# Altium schematic sheet HD1772.SchDoc: ARM2 to ARM3 Adapter
size A3; DocumentNumber: 1; SheetNumber: 1; SheetTotal: 1
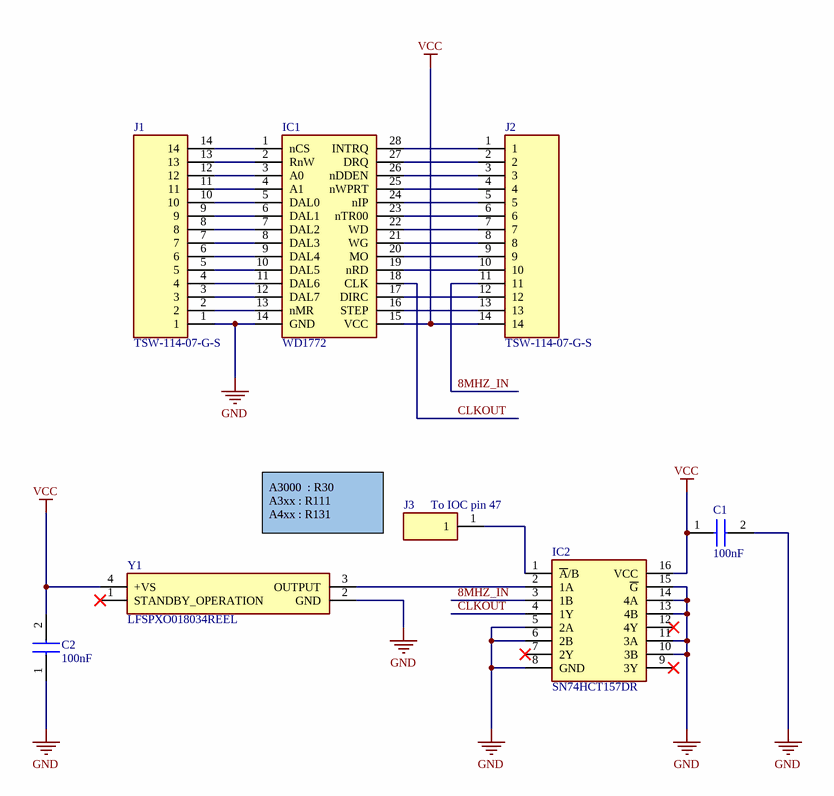
[diagram p0: HD1772.SchDoc]

## Parts
C1  100nF  [CAPC2012X145N]
C2  100nF  [CAPC2012X145N]
IC1  WD1772  [DIP1556W56P254L3740H635Q28N]
IC2  SN74HCT157DR  [SOIC127P600X175-16N]
J1  TSW-114-07-G-S  [TSW-114-XX-YY-S]
J2  TSW-114-07-G-S  [TSW-114-XX-YY-S]
J3  To IOC pin 47  [TSW-101-XX-YY-S]
Y1  LFSPXO018034REEL  [LFSPXO018034REEL]

## Nets
GND: C1.2 C2.1 IC1.14(GND) IC2.5(2A) IC2.6(2B) IC2.8(GND) IC2.10(3B) IC2.11(3A) IC2.13(4B) IC2.14(4A) IC2.15(~{G}) J1.1 Y1.2(GND)
VCC: C1.1 C2.2 IC1.15(VCC) IC2.16(VCC) J2.14 Y1.4(+VS)
8MHZ_IN: IC2.3(1B) J2.11
CLKOUT: IC1.18(CLK) IC2.4(1Y)
NetIC1_1: IC1.1(nCS) J1.14
NetIC1_2: IC1.2(RnW) J1.13
NetIC1_3: IC1.3(A0) J1.12
NetIC1_4: IC1.4(A1) J1.11
NetIC1_5: IC1.5(DAL0) J1.10
NetIC1_6: IC1.6(DAL1) J1.9
NetIC1_7: IC1.7(DAL2) J1.8
NetIC1_8: IC1.8(DAL3) J1.7
NetIC1_9: IC1.9(DAL4) J1.6
NetIC1_10: IC1.10(DAL5) J1.5
NetIC1_11: IC1.11(DAL6) J1.4
NetIC1_12: IC1.12(DAL7) J1.3
NetIC1_13: IC1.13(nMR) J1.2
NetIC1_16: IC1.16(STEP) J2.13
NetIC1_17: IC1.17(DIRC) J2.12
NetIC1_19: IC1.19(nRD) J2.10
NetIC1_20: IC1.20(MO) J2.9
NetIC1_21: IC1.21(WG) J2.8
NetIC1_22: IC1.22(WD) J2.7
NetIC1_23: IC1.23(nTR00) J2.6
NetIC1_24: IC1.24(nIP) J2.5
NetIC1_25: IC1.25(nWPRT) J2.4
NetIC1_26: IC1.26(nDDEN) J2.3
NetIC1_27: IC1.27(DRQ) J2.2
NetIC1_28: IC1.28(INTRQ) J2.1
NetIC2_1: IC2.1(~{A}/B) J3.1
NetIC2_2: IC2.2(1A) Y1.3(OUTPUT)

Not connected (* = marked no-connect by the designer): IC2 7(2Y)* 9(3Y)* 12(4Y)*; Y1 1(STANDBY_OPERATION)*

## Notes on the sheet
- A3000  : R30
  A3xx : R111
  A4xx : R131
- SIZE
- CODION LTD
- DIMENSIONS
- TITLE
- VARIANT
- REVISION
- DATE
- A3
- SHEET
- OF
- FILE
- DRAWN BY

## Library data of the parts
C1 C2 = C2012X7R1H104K125AM: Capacitor; Manufacturer_Name: TDK; Datasheet Link: https://product.tdk.com/info/en/catalog/datasheets/mlcc_commercial_midvoltage_en.pdf; Height: 1.45mm; Manufacturer_Part_Number: C2012X7R1H104K125AM; Mouser Part Number: 810-C2012X7R1H104KT5; Mouser Price/Stock: https://www.mouser.com/Search/Refine.aspx?Keyword=810-C2012X7R1H104KT5; Arrow Part Number: C2012X7R1H104K125AM; Arrow Price/Stock: https://www.arrow.com/en/products/c2012x7r1h104k125am/tdk
IC1 = WD1772: Integrated Circuit; Height: 6.35mm; Manufacturer_Part_Number: WD1772
IC2 = SN74HCT157DR: Integrated Circuit; Manufacturer_Name: Texas Instruments; Datasheet Link: http://www.ti.com/lit/ds/symlink/sn74hct157.pdf; Height: 1.75mm; Manufacturer_Part_Number: SN74HCT157DR; Mouser Part Number: 595-SN74HCT157DR; Mouser Price/Stock: https://www.mouser.co.uk/ProductDetail/Texas-Instruments/SN74HCT157DR?qs=SL3LIuy2dWwDjupbumH9IA%3D%3D; Arrow Part Number: SN74HCT157DR; Arrow Price/Stock: https://www.arrow.com/en/products/sn74hct157dr/texas-instruments
J1 J2 = TSW-114-07-G-S: Connector; Manufacturer_Name: SAMTEC; Datasheet Link: http://suddendocs.samtec.com/prints/tsw-xxx-xx-xxx-x-xx-xxx-mkt.pdf; Manufacturer_Part_Number: TSW-114-07-G-S; Mouser Part Number: 200-TSW11407GS; Mouser Price/Stock: https://www.mouser.co.uk/ProductDetail/Samtec/TSW-114-07-G-S?qs=rU5fayqh%252BE2%2Ft1%252BlziCVkQ%3D%3D
J3 = TSW-101-07-G-S: Connector; Manufacturer_Name: SAMTEC; Datasheet Link: http://suddendocs.samtec.com/prints/tsw-xxx-xx-xxx-x-xx-xxx-mkt.pdf; Manufacturer_Part_Number: TSW-101-07-G-S; Mouser Part Number: 200-TSW10107GS; Mouser Price/Stock: https://www.mouser.co.uk/ProductDetail/Samtec/TSW-101-07-G-S?qs=hzq9O0YpnZscfPe5oPvABA%3D%3D; Arrow Part Number: TSW-101-07-G-S; Arrow Price/Stock: https://www.arrow.com/en/products/tsw-101-07-g-s/samtec?region=europe
Y1 = LFSPXO018034REEL: Crystal or Oscillator; Manufacturer_Name: IQD; Datasheet Link: https://componentsearchengine.com/Datasheets/1/LFSPXO018034Reel.pdf; Height: 1.4mm; Manufacturer_Part_Number: LFSPXO018034REEL; Mouser Part Number: 449-LFSPXO018034REEL; Mouser Price/Stock: https://www.mouser.co.uk/ProductDetail/IQD/LFSPXO018034Reel?qs=nFovR%252B4R4UNGKBIfMWn6Ew%3D%3D